# EAGLE design expansion_module_triple_I2C (EAGLE 9.6.2)
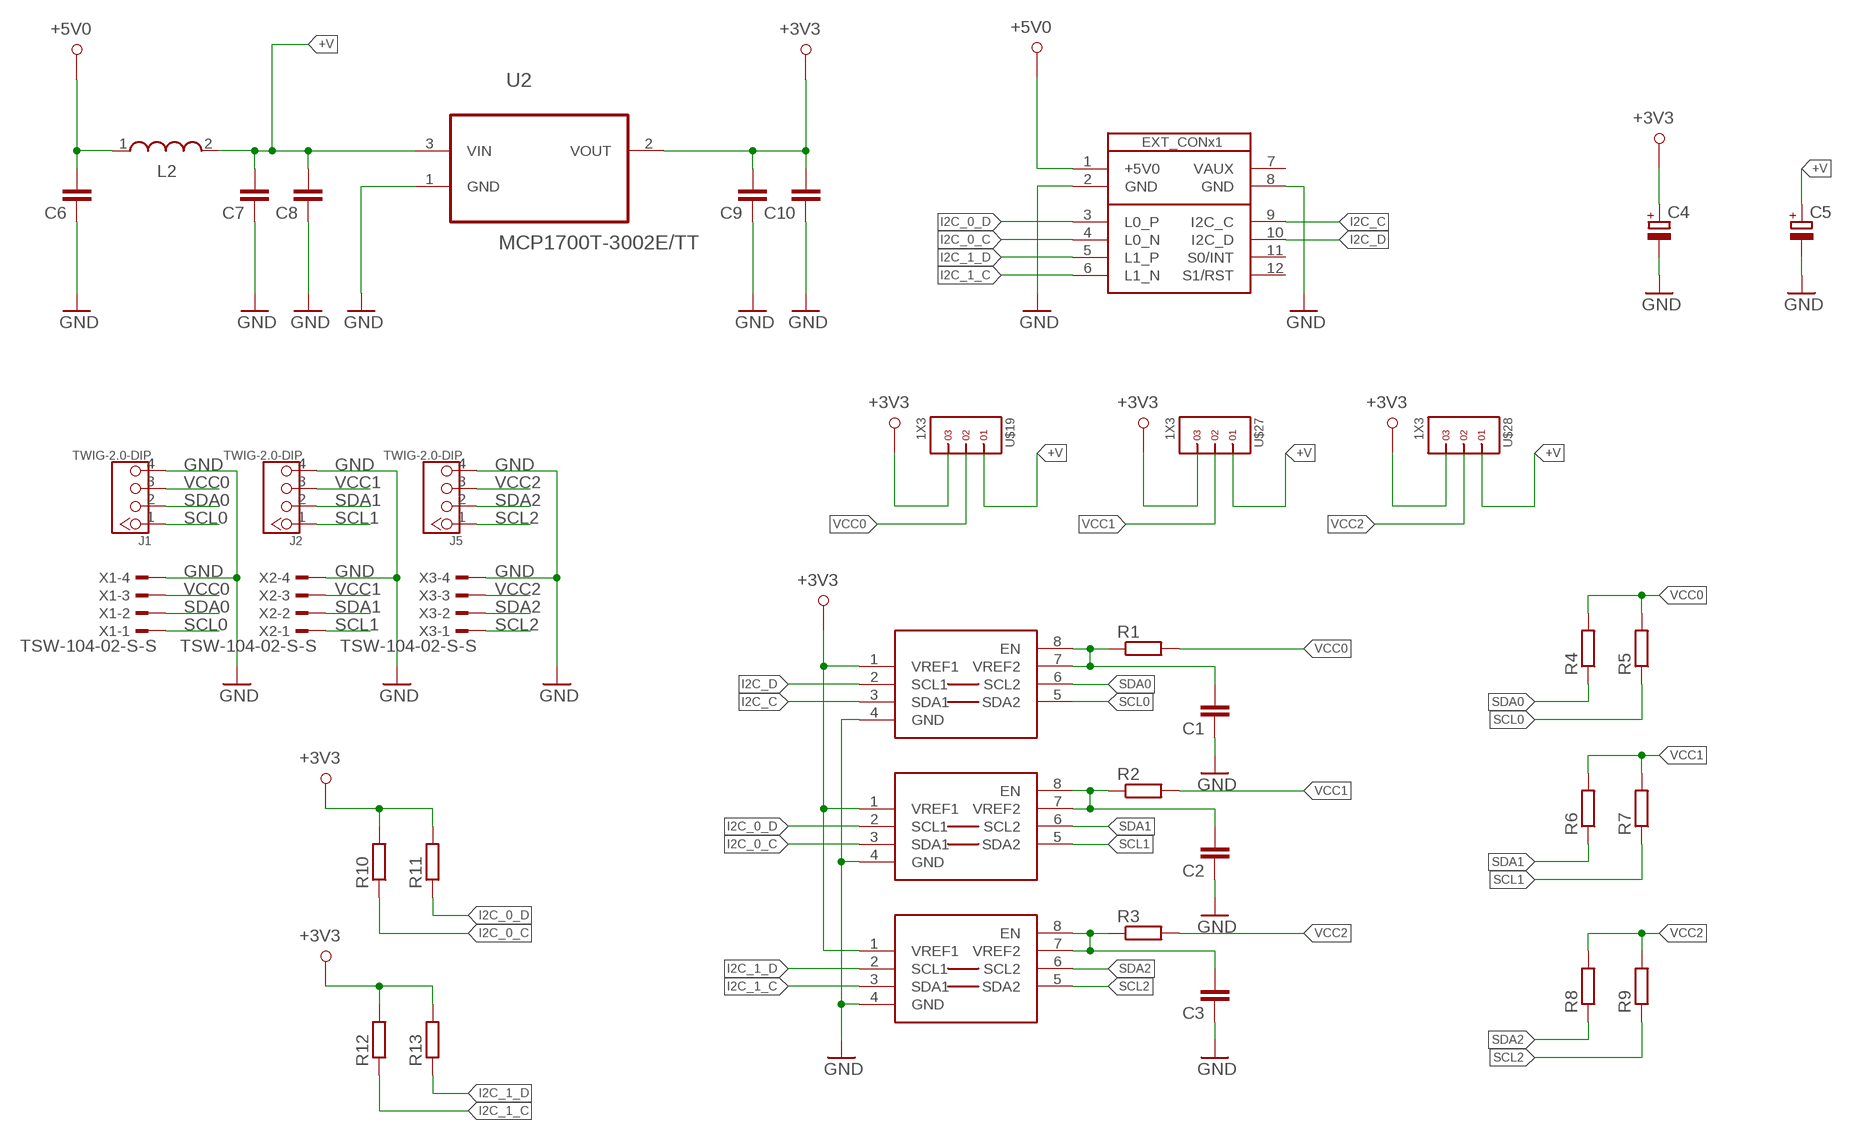
[diagram p0: schematic, sheet 1]

## Parts
C1  C-EUC0603  [C0603]
C2  C-EUC0603  [C0603]
C3  C-EUC0603  [C0603]
C4  CPOL-EUSMCB  [SMC_B]
C5  CPOL-EUSMCB  [SMC_B]
C6  C-EUC0603  [C0603]
C7  C-EUC0603  [C0603]
C8  C-EUC0603  [C0603]
C9  C-EUC0603  [C0603]
C10  C-EUC0603  [C0603]
J1  TWIG-2.0-DIP  [2.0_1X4]
J2  TWIG-2.0-DIP  [2.0_1X4]
J5  TWIG-2.0-DIP  [2.0_1X4]
L2  WE-LQ_1210  [WE-LQ_M]
R1  R-EU_R0603  [R0603]
R2  R-EU_R0603  [R0603]
R3  R-EU_R0603  [R0603]
R4  R-EU_R0603  [R0603]
R5  R-EU_R0603  [R0603]
R6  R-EU_R0603  [R0603]
R7  R-EU_R0603  [R0603]
R8  R-EU_R0603  [R0603]
R9  R-EU_R0603  [R0603]
R10  R-EU_R0603  [R0603]
R11  R-EU_R0603  [R0603]
R12  R-EU_R0603  [R0603]
R13  R-EU_R0603  [R0603]
U2  MCP1700T-3002E/TT  [SOT95P237X112-3N]
U$2  SB_EXT_CON_X1  [SB_EXT_CON_X1_FULL]
U$16  PCA9306  [PSOP-8]
U$19  1X3  [1X3]
U$20  PCA9306  [PSOP-8]
U$27  1X3  [1X3]
U$28  1X3  [1X3]
U$31  PCA9306  [PSOP-8]
X1  TSW-104-02-S-S  [TSW-104-02-S-S]
X2  TSW-104-02-S-S  [TSW-104-02-S-S]
X3  TSW-104-02-S-S  [TSW-104-02-S-S]

## Nets
+3V3: C4.+ C9.2 C10.2 R10.2 R11.2 R12.2 R13.2 U2.2(VOUT) U$16.1(VREF1) U$19.3 U$20.1(VREF1) U$27.3 U$28.3 U$31.1(VREF1)
+5V0: C6.2 L2.1 U$2.1(+5V0)
+V: C5.+ C7.2 C8.2 L2.2 U2.3(VIN) U$19.1 U$27.1 U$28.1
GND: C1.1 C2.1 C3.1 C4.- C5.- C6.1 C7.1 C8.1 C9.1 C10.1 J1.4 J2.4 J5.4 U2.1(GND) U$2.2(GND) U$2.8(GND) U$16.4(GND) U$20.4(GND) U$31.4(GND) X1.4 X2.4 X3.4
I2C_0_C: R10.1 U$2.4(L0_N) U$20.3(SDA1)
I2C_0_D: R11.1 U$2.3(L0_P) U$20.2(SCL1)
I2C_1_C: R12.1 U$2.6(L1_N) U$31.3(SDA1)
I2C_1_D: R13.1 U$2.5(L1_P) U$31.2(SCL1)
I2C_C: U$2.9(I2C_C) U$16.3(SDA1)
I2C_D: U$2.10(I2C_D) U$16.2(SCL1)
N$2: C1.2 R1.1 U$16.7(VREF2) U$16.8(EN)
N$5: C2.2 R2.1 U$20.7(VREF2) U$20.8(EN)
N$7: C3.2 R3.1 U$31.7(VREF2) U$31.8(EN)
SCL0: J1.1 R5.1 U$16.5(SDA2) X1.1
SCL1: J2.1 R7.1 U$20.5(SDA2) X2.1
SCL2: J5.1 R9.1 U$31.5(SDA2) X3.1
SDA0: J1.2 R4.1 U$16.6(SCL2) X1.2
SDA1: J2.2 R6.1 U$20.6(SCL2) X2.2
SDA2: J5.2 R8.1 U$31.6(SCL2) X3.2
VCC0: J1.3 R1.2 R4.2 R5.2 U$19.2 X1.3
VCC1: J2.3 R2.2 R6.2 R7.2 U$27.2 X2.3
VCC2: J5.3 R3.2 R8.2 R9.2 U$28.2 X3.3
Unconnected: U$2.7(VAUX) U$2.11(S0/INT) U$2.12(S1/RST)

## Library data of the parts
C1-C3 C6-C10 = resistor:C-EU: CAPACITOR, European symbol
C4 C5 = rcl:CPOL-EU: POLARIZED CAPACITOR, European symbol
J1 J2 J5 = Connector:TWIG-2.0-DIP
L2 = EagleLibrary_Wuerth_Elektronik_eiSos_rev16a:WE-LQ: SMD Inductor Characteristics Miniature chip inductor wound on a special ferrite core Small inductances for compact circuits High Q at high frequencies Low DC-resistance Operating temperature: –40 ºC to +125 ºC Applications Low power DC/DC-converters from Linear Technology, National Semiconductor, Texas Instruments, Fairchild Semiconductor, ON Semiconductor, STMicroelectronics, Maxim, MPS, Semtech, Exar, Analogic Tech, Diodes and Cologne Chip EMI-Filtering RF-circuits <http://katalog.we-online.de/media/images/eisos/IndLQ_pf2.jpg> Details see: http://katalog.we-online.de/en/pbs/WE-LQ? Updated by Dan Xu 2014-07-08 2014 (C) Wurth Elektronik
R1-R13 = rcl:R-EU_: RESISTOR, European symbol
U2 = Microchip_By_element14_Batch_1:MCP1700T-3002E/TT: Low Quiescent Current LDO; MPN: MCP1700T-3002E/TT; OC_FARNELL: 1331482; OC_NEWARK: 84R5176; PACKAGE: SOT23-3; SUPPLIER: Microchip
U$2 = al_smartboard:SB_EXT_CON_X1
U$16 U$20 U$31 = SparkFun-DigitalIC:PCA9306: Bidirectional I2C level shifter. NOT compatible with all available part number pinout schemes- DOUBLE CHECK!!!
U$19 U$27 U$28 = headers(2mm):1X3
X1-X3 = con-samtec:TSW-104-02-S-S: THROUGH-HOLE .025" SQ POST HEADER Source: Samtec TSW.pdf; OC_FARNELL: unknown; OC_NEWARK: unknown

## Board
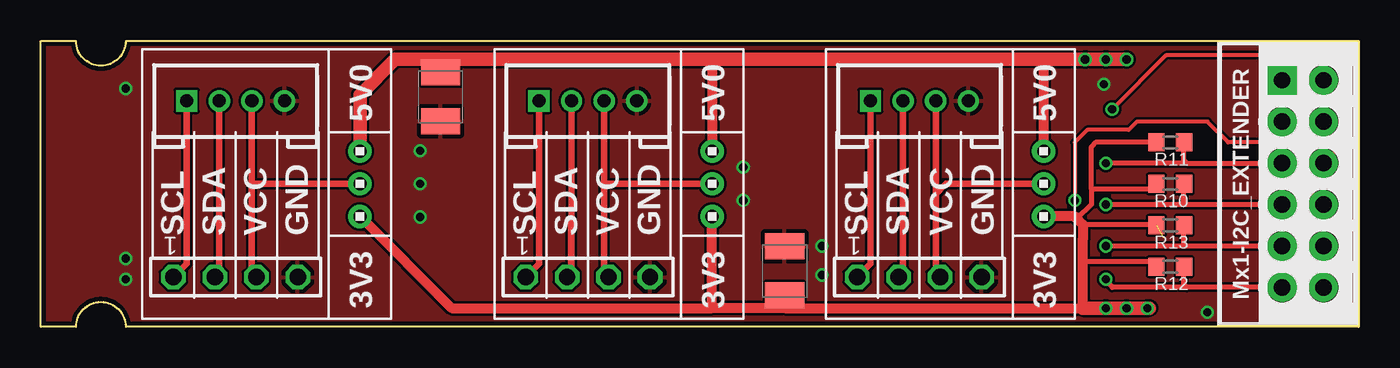
[diagram p1: board, top side]
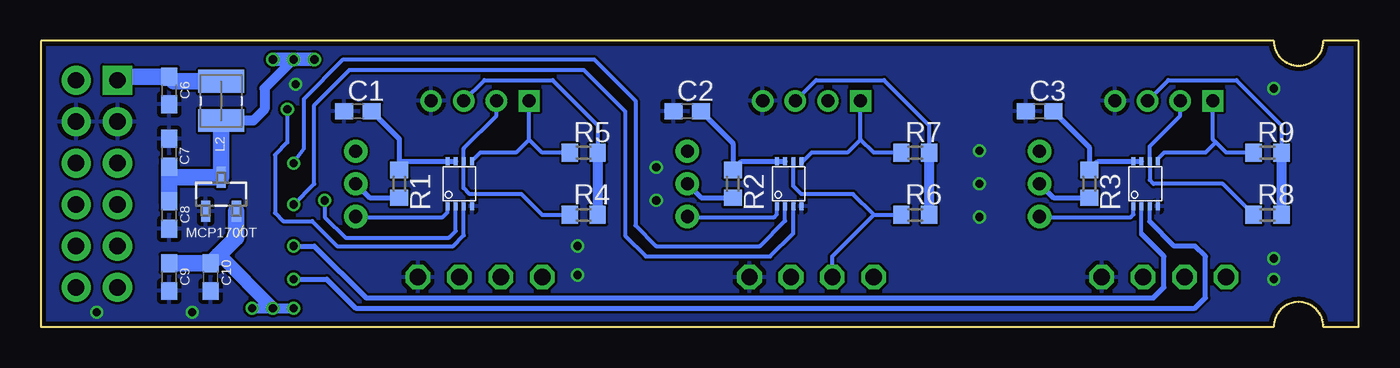
[diagram p2: board, bottom side, seen from below]

Size 80.77 x 17.53 mm. Coordinates in mm from the lower left corner, seen from the top.
Copper layers (1*16): Top 0.035mm / dielectric 1.5mm / Bottom 0.035mm
Design rules "default": minimum track width 6mil, minimum drill 12mil, track to track 6mil, track to pad 6mil, pad to pad 6mil, via to via 6mil, smd to smd 0mil, copper to edge 10mil, drill to drill 10mil, minimum pad ring 10mil, minimum via ring 6mil, stop-mask expansion 2mil, vias tented up to drill 100mil, thermal gap 10mil

### Footprints (pad centres in the part's own frame; a part is rotated, then mirrored left to right if it is on the bottom)
C0603 = smd 1.1 x 1: 1 -0.85,0; 2 0.85,0
SMC_B = smd 1.6 x 2.4: + -1.5,0; - 1.5,0
2.0_1X4 = drill 0.8 pad 1.27 square: 1 -3,0 | drill 0.8 pad 1.27: 2 -1,0; 3 1,0; 4 3,0
WE-LQ_M = smd 1.4 x 2.8: 1 -1.2,0; 2 1.2,0
R0603 = smd 1 x 1.1: 1 -0.85,0; 2 0.85,0
SOT95P237X112-3N = smd 0.559 x 1.27: 1 -0.94,-1.041; 2 0.94,-1.041; 3 0,1.041
SB_EXT_CON_X1_FULL = drill 1 pad 1.778 square: 1 15.24,5.08 | drill 1 pad 1.778: 2 12.7,5.08; 3 10.16,5.08; 4 7.62,5.08; 5 5.08,5.08; 6 2.54,5.08; 7 15.24,2.54; 8 12.7,2.54; 9 10.16,2.54; 10 7.62,2.54; 11 5.08,2.54; 12 2.54,2.54
PSOP-8 = smd 0.25 x 0.5: 1 -0.73,-1.37; 2 -0.23,-1.37; 3 0.27,-1.37; 4 0.77,-1.37; 5 0.77,1.38; 6 0.27,1.38; 7 -0.23,1.38; 8 -0.73,1.38
1X3 = drill 0.8 pad 1.422: 1 -2,0; 2 0,0; 3 2,0
TSW-104-02-S-S = drill 1 pad 1.5 octagon: 1 3.81,0; 2 1.27,0; 3 -1.27,0; 4 -3.81,0

### Placement (x,y rotation side)
C1  61.34,13.21 0 bottom
C2  41.15,13.21 0 bottom
C3  19.56,13.21 0 bottom
C4  45.59,3.43 90 top
C5  24.51,14.1 270 top
C6  72.9,14.48 90 bottom
C7  72.9,10.67 270 bottom
C8  72.9,6.86 90 bottom
C9  72.9,3.05 90 bottom
C10  70.36,3.05 90 bottom
J1  53.85,13.84 0 top
J2  33.53,13.84 0 top
J5  11.94,13.84 0 top
L2  69.72,13.84 270 bottom
R1  58.8,8.76 270 bottom
R2  38.35,8.76 270 bottom
R3  16.51,8.76 270 bottom
R4  47.5,6.86 0 bottom
R5  47.5,10.67 0 bottom
R6  27.18,6.86 0 bottom
R7  27.18,10.67 0 bottom
R8  5.59,6.86 0 bottom
R9  5.59,10.67 0 bottom
R10  69.22,8.76 180 top
R11  69.22,11.3 180 top
R12  69.22,3.68 180 top
R13  69.22,6.22 180 top
U2  69.72,8.13 0 bottom
U$2  81.15,-0.13 90 top
U$16  55.12,8.76 0 bottom
U$19  61.47,8.76 270 top
U$20  34.93,8.76 0 bottom
U$27  41.15,8.76 270 top
U$28  19.56,8.76 270 top
U$31  13.08,8.76 0 bottom
X1  53.85,3.05 180 top
X2  33.53,3.05 180 top
X3  11.94,3.05 180 top

### Tracks (layer width: path | path; a pad name or v marks a point on that pad's centre or on a via)
+3V3  (via drill 0.5)  (1 unrouted)
  Top 0.305: R11.2 64.64,11.3 64.39,11.05 64.39,8.42 | 63.88,3.98 63.88,1.14 | 63.88,3.98 63.88,5.43 | R12.2 68.07,3.98 63.88,3.98 | 68.3,8.69 R10.2 68.02,8.42 64.39,8.42 | 63.57,6.57 63.57,6.68 64.39,7.49 64.39,8.42 | R13.2 68.33,6.26 63.88,6.26
  Top 0.61: U$28.3 25.18,1.14 41.15,1.14 | 63.88,1.14 v65.28,1.14 | 41.15,1.14 U$27.3 | 63.88,1.14 63.88,5.43 63.88,6.26 63.57,6.57 63.38,6.76 U$19.3 | 67.95,1.14 65.41,1.14 | 45.61,1.14 41.15,1.14 | 45.61,1.14 63.88,1.14 | C4.+ 45.61,1.91 45.61,1.14
  Top 0.813: 63.88,1.14 67.95,1.14
  Bottom 0.254: U$19.3 61.44,6.73 56.13,6.73 55.85,7.02 U$16.1 | U$27.3 41.12,6.73 35.81,6.73 35.66,6.89 U$20.1 | U$28.3 19.53,6.73 13.97,6.73 13.81,6.89 U$31.1
  Bottom 0.61: 72.52,3.9 C9.2 | v67.82,1.14 v65.28,1.14
  Bottom 0.813: v66.55,1.14 69.78,4.38 69.88,4.38
  Bottom 1.016: U2.2 68.78,5.47 69.88,4.38 C10.2 72.52,3.9
+5V0
  Bottom 1.016: L2.1 72.61,15.04 C6.2 75.86,15.33 U$2.1
+V  (via drill 0.5)
  Top 0.61: U$19.1 61.47,16.38 | 41.15,16.38 U$27.1
  Top 0.813: v66.55,16.38 v64.01,16.38 61.47,16.38 41.15,16.38 24.44,16.38 | U$28.1 19.56,14.22 21.72,16.38 24.44,16.38 | C5.+ 24.44,15.67 24.44,16.38
  Bottom 0.61: v65.28,16.38 67.06,14.61 67.06,13.33 67.75,12.64 L2.2
  Bottom 0.813: v66.55,16.38 v65.28,16.38 v64.01,16.38
  Bottom 1.016: L2.2 U2.3 72.8,9.17 72.9,9.27 | 72.9,9.27 C7.2 | 72.9,9.27 C8.2
GND  (via drill 0.5)
  other vias: 23.24,10.79 23.24,8.76 23.24,6.73 43.05,9.78 43.05,7.75 65.15,14.86 71.5,0.89 77.34,0.89 5.21,2.92 5.21,4.19 5.21,14.61 47.88,4.95 47.88,3.18
  pour Bottom (rank 2): 67.82,16.38 67.82,1.14 74.17,1.14 74.17,16.38
  pour Top: 0,17.53 80.77,17.53 80.77,0 0,0
  pour Bottom: -0.13,17.65 81.15,17.65 81.15,-0.13 -0.76,-0.13 -0.76,17.65
I2C_0_C  (via drill 0.5)
  Top 0.305: U$2.4 69.98,7.49 | 69.98,7.49 v65.28,7.49 | 69.98,7.49 70.07,7.58 R10.1
  Bottom 0.254: v65.28,7.49 64.01,8.76 64.01,13.59 61.85,15.75 47.5,15.75 44.96,13.21 44.96,5.59 43.69,4.32 36.07,4.32 34.66,5.73 U$20.3
I2C_0_D  (via drill 0.5)
  Top 0.305: 70.23,10.03 U$2.3 | 70.23,10.03 70.07,10.2 R11.1 | 70.23,10.03 v65.28,10.03
  Bottom 0.254: 65.2,10.14 64.64,10.92 64.64,13.97 62.23,16.38 46.86,16.38 44.32,13.84 44.32,6.22 43.05,4.95 36.7,4.95 35.16,6.5 U$20.2
  Bottom 0.305: v65.28,10.03 65.2,10.11 65.2,10.14
I2C_1_C  (via drill 0.5)
  Top 0.305: U$2.6 70.23,2.41 | 70.23,2.41 70.07,2.58 R12.1 | v65.28,2.92 65.28,2.79 65.66,2.41 70.23,2.41
  Bottom 0.254: 12.81,6.46 U$31.3
  Bottom 0.305: v65.28,2.92 63.25,2.92 61.47,1.14 10.03,1.14 9.4,1.78 9.4,4.32 10.03,4.95 11.3,4.95 12.81,6.46
I2C_1_D  (via drill 0.5)
  Top 0.305: U$2.5 69.98,4.95 | 69.98,4.95 v65.28,4.95 | 69.98,4.95 70.07,5.04 R13.1
  Bottom 0.254: 13.31,5.69 U$31.2
  Bottom 0.305: v65.28,4.95 64.01,4.95 60.83,1.78 12.57,1.78 11.94,2.41 11.94,4.32 13.31,5.69
I2C_C  (via drill 0.5)
  Top 0.254: U$2.9 80.14,11.56 80.14,15.87 79.38,16.64 68.96,16.64 v65.66,13.33
  Bottom 0.254: v65.66,13.33 65.66,11.3 66.42,10.54 66.42,6.98 65.91,6.48 64.14,6.48 62.61,4.95 55.5,4.95 54.85,5.6 U$16.3
I2C_D  (via drill 0.5)
  Top 0.254: U$2.10 77.34,8.76 77.34,11.05 77.09,11.3 72.77,11.3 71.5,12.57 67.18,12.57 66.68,12.07 64.14,12.07 63.37,11.3 v63.37,7.75
  Bottom 0.254: v63.37,7.75 63.37,6.73 62.1,5.46 55.75,5.46 55.35,5.87 U$16.2
N$2
  Bottom 0.305: C1.2 58.8,11.52 58.8,10.16 | 58.8,10.16 R1.1 | 58.8,10.16 58.78,10.14 U$16.8 U$16.7
N$5
  Bottom 0.305: C2.2 38.35,11.26 R2.1 37.82,10.14 U$20.8 U$20.7
N$7
  Bottom 0.305: C3.2 16.51,11.01 R3.1 15.98,10.14 U$31.8 U$31.7
SCL0
  Top 0.254: 50.85,5.46 50.93,5.54 50.93,6.6
  Top 0.406: X1.1 50.85,3.86 50.85,5.46 J1.1
  Bottom 0.254: R5.1 50.04,10.67 50.85,11.48 | 50.85,11.48 J1.1 | 50.85,11.48 51.66,10.67 53.85,10.67 54.35,10.17 U$16.5
SCL1
  Top 0.254: 30.53,5.84 30.48,5.89 30.48,6.48
  Top 0.406: X2.1 30.53,3.86 30.53,5.84 J2.1
  Bottom 0.254: 34.16,10.08 34.16,9.9 | 34.16,10.08 U$20.5 | R7.1 29.72,10.67 30.53,11.48 | 30.53,11.48 J2.1 | 30.53,11.48 31.34,10.67 33.53,10.67 34.12,10.08 34.16,10.08
SCL2
  Top 0.406: X3.1 8.94,3.86 J5.1
  Bottom 0.254: R9.1 8.13,10.67 8.76,11.3 | 8.76,11.3 8.94,11.48 J5.1 | 8.76,11.3 9.4,10.67 11.94,10.67 12.31,10.29 U$31.5
SDA0
  Top 0.254: 52.85,5.59 52.85,6.64
  Top 0.406: X1.2 52.85,3.32 52.85,5.59 52.83,5.6 52.83,6.6 | 52.85,6.64 J1.2
  Bottom 0.254: R4.1 50.04,6.86 51.31,8.13 54.48,8.13 54.86,8.51 54.86,10.13 U$16.6 54.85,10.94 52.85,12.94 J1.2
SDA1
  Top 0.406: J2.2 32.53,3.32 X2.2 32.51,3.3 32.51,6.48
  Bottom 0.254: X2.2 32.26,4.32 29.72,6.86 | 29.72,6.86 R6.1 | 29.72,6.86 30.99,8.13 34.16,8.13 34.66,8.62 U$20.6
  Bottom 0.305: 31.84,3.05 X2.2
SDA2
  Top 0.406: X3.2 10.94,3.32 J5.2
  Bottom 0.254: R8.1 8.34,8.76 12.57,8.76 12.81,9 U$31.6 12.81,11.07 10.94,12.94 J5.2
VCC0
  Top 0.406: X1.3 54.85,3.32 54.85,8.13 | 54.85,8.13 J1.3 | 54.85,8.13 55.48,8.76 U$19.2
  Bottom 0.254: J1.3 53.58,15.11 49.4,15.11 46.65,12.36 R5.2
  Bottom 0.305: U$19.2 60.62,7.91 R1.2
  Bottom 0.61: R5.2 R4.2
VCC1
  Top 0.406: X2.3 34.53,3.32 34.53,8.76 | 34.53,8.76 J2.3 | 34.53,8.76 U$27.2
  Bottom 0.254: J2.3 33.26,15.11 29.08,15.11 26.33,12.36 R7.2
  Bottom 0.305: U$27.2 40.3,7.91 R2.2
  Bottom 0.61: R7.2 R6.2
VCC2
  Top 0.406: X3.3 12.94,3.32 12.94,8.76 | 12.94,8.76 J5.3 | 12.94,8.76 U$28.2
  Bottom 0.254: J5.3 11.67,15.11 7.49,15.11 4.74,12.36 R9.2
  Bottom 0.305: U$28.2 18.71,7.91 R3.2
  Bottom 0.61: R9.2 R8.2

### Text on the board
tPlace: 5V0 | 5V0 | 5V0 | Mx1-I2C_EXTENDER | SCL | SDA | VCC | GND | SCL | SDA | VCC | GND | SCL | SDA | VCC | GND | 3V3 | 3V3 | 3V3
bNames: MCP1700T